# Altium schematic sheet Ambient Light Sensor.SchDoc
size Letter; Organization: Midnight Sun Solar Rayce Car Team; Address1: University of Waterloo; Address2: 200 University Ave W; Address3: Waterloo, ON, Canada; Address4: N2L 3E9; Website: www.uwmidsun.com
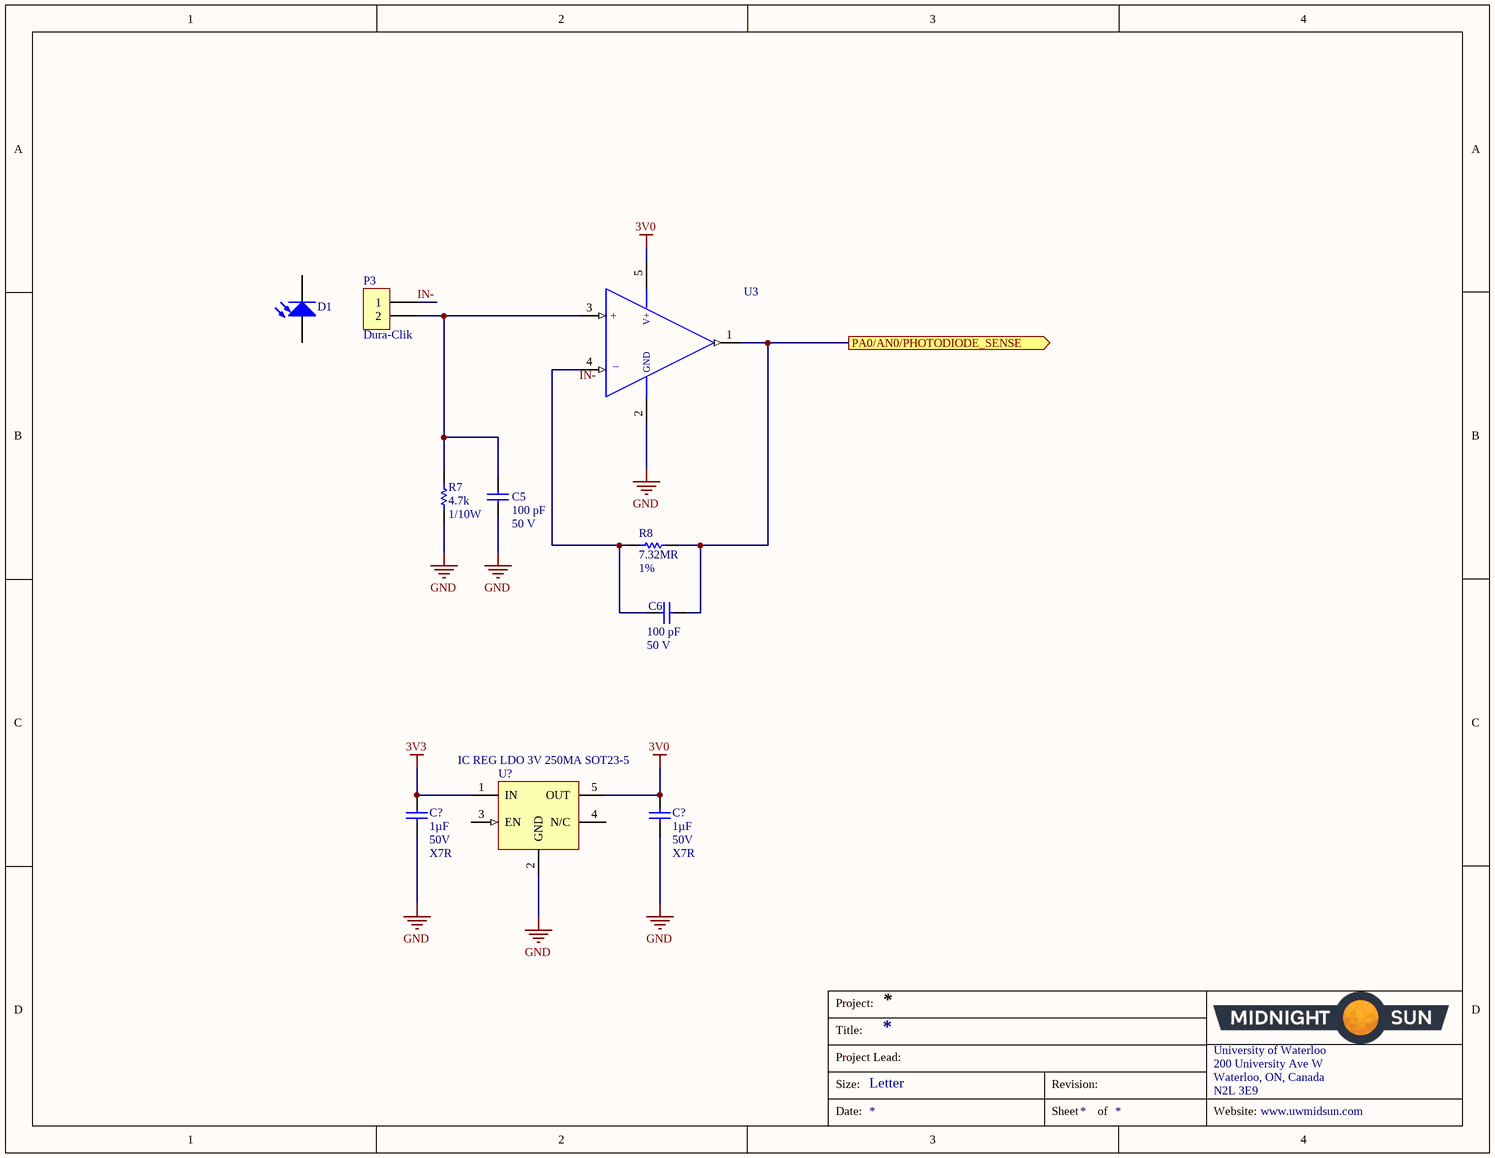
[diagram p0: Ambient Light Sensor.SchDoc]

## Parts
(Parts that share a designator on the sheet are numbered #1, #2 ... from top to bottom, then left to right.)
C5  CAP CER 100PF 50V C0G/NP0 0603  [CAP, 0603]  (value not drawn)
C6  CAP CER 100PF 50V C0G/NP0 0603  [CAP, 0603]  (value not drawn)
C?#1  Capacitance: 1µF  Voltage: 50V  Temperature Coefficient: X7R  [CAP, 0603]  (hidden comment: CAP CER 1UF 50V 10% X7R 0603)
C?#2  Capacitance: 1µF  Voltage: 50V  Temperature Coefficient: X7R  [CAP, 0603]  (hidden comment: CAP CER 1UF 50V 10% X7R 0603)
D1  DIODE 880NM W/FLTR THRUHOLE  (value not drawn)  (graphical)
P3  Dura-Clik  [CONN, 2POS Dura-Click Vertical]
R7  Resistance (Ohms): 4.7k  Power (Watts): 1/10W  [RES, 0603]  (hidden comment: RES 4.7K OHM 1% 1/10W 0603)
R8  Resistance: 7.32MR  Tolerance: 1%  [RES, 0603]  (hidden comment: RES 7.32M OHM 1% 1/10W 0603)
U3  IC OP AMP GEN PURPOSE RR 10MHZ SOT-23-5  [IC OP AMP GP RR 10MHZ SOT-23-5]  (value not drawn)
U?  IC REG LDO 3V 250MA SOT23-5  [SOT95P280X145-5N]

## Ports
PA0/AN0/PHOTODIODE_SENSE (out)

## Nets
3V0: C?#2.1 U3.5(VDD) U?.5(OUT)
3V3: C?#1.1 U?.1(IN)
GND: C5.2 C?#1.2 C?#2.2 R7.1 U3.2(VSS) U?.2(GND)
IN-: P3.1
PA0/AN0/PHOTODIODE_SENSE: C6.2 R8.1 U3.1(OUTPUT) ; port PA0/AN0/PHOTODIODE_SENSE
NetC5_1: C5.1 P3.2 R7.2 U3.3(+IN)
NetC6_1: C6.1 R8.1 U3.4(-IN)

Not connected (* = marked no-connect by the designer): D1 1(A) 2(K); U? 3(EN) 4(N/C)

## Notes on the sheet
- (near C5) 100 pF
- (near C5) 50 V
- (near C6) 100 pF
- (near C6) 50 V
- Project:
- Title:
- Size:
- Project Lead:
- Letter
- Revision:
- University of Waterloo
- 200 University Ave W
- Waterloo, ON, Canada
- N2L 3E9
- Date:
- Sheet
- of
- Website:
- Labels drawn without touching a wire or pin: IN-
- (in symbol IC OP AMP GEN PURPOSE RR 10MHZ SOT-23-5) V+; +; GND; _

## Library data of the parts
C5 C6 = CAP CER 100PF 50V C0G/NP0 0603: 100pF ±1% 50V Ceramic Capacitor C0G, NP0 0603 (1608 Metric); Manufacturer: Kyocera AVX; Manufacturer Part Number: 06035A101FAT2A; Supplier 1: Digi-Key; Stock 1: 176069; Pricing 1: 1=0.24, 10=0.161, 100=0.0814, 500=0.0557, 1000=0.0493 (USD); Mount: Surface Mount; Case/Package: 0603; Case Code (Imperial): 0603; Case Code (Metric): 1608; Min Operating Temperature: -55°C; Max Operating Temperature: 125°C; Capacitance: 100pF; Tolerance: 1%; Packaging: Tape and Reel; Voltage Rating: 50V; Package Quantity: 1; Voltage Rating (DC): 50V; Dielectric: C0G; Termination: SMD/SMT; Voltage: 50V; Length: 1.6mm; Height: 0.86mm; Width: 0.81mm; Thickness: 0.035inch; Depth: 0.81mm; Radiation Hardening: No; REACH SVHC: No SVHC; Lead Free: Lead Free; ComponentLink1URL: https://datasheet.ciiva.com/22682/1796416-22682854.pdf; ComponentLink1Description: https://datasheet.ciiva.com/22682/1796416-22682854.pdf; ComponentLink2URL: https://datasheet.ciiva.com/150/ccog-150746.pdf; ComponentLink2Description: https://datasheet.ciiva.com/150/ccog-150746.pdf; ComponentLink3URL: https://datasheet.ciiva.com/150/ccog-150747.pdf; ComponentLink3Description: https://datasheet.ciiva.com/150/ccog-150747.pdf; ComponentLink4URL: https://datasheet.ciiva.com/150/ccog-150748.pdf; ComponentLink4Description: https://datasheet.ciiva.com/150/ccog-150748.pdf; ComponentLink5URL: https://datasheet.ciiva.com/28585/1796416-28585980.pdf; ComponentLink5Description: https://datasheet.ciiva.com/28585/1796416-28585980.pdf; ComponentLink6URL: https://datasheet.ciiva.com/16300/ccog-16300413.pdf; ComponentLink6Description: https://datasheet.ciiva.com/16300/ccog-16300413.pdf; ComponentLink7URL: https://datasheet.ciiva.com/17492/ccog-17492189.pdf; ComponentLink7Description: https://datasheet.ciiva.com/17492/ccog-17492189.pdf; Supplier Part Number 1: 478-6202-1-ND
C?#1 C?#2 = CAP CER 1UF 50V 10% X7R 0603: 1µF ±10% 50V Ceramic Capacitor X7R 0603 (1608 Metric); Manufacturer 1: Taiyo Yuden; Manufacturer Part Number 1: UMK107AB7105KA-T; Supplier 1: Digi-Key; Supplier Part Number 1: 587-3247-1-ND; Packaging: Cut Tape (CT); Part Status: Active; Operating Temperature: -55°C ~ 125°C; Ratings: -; Mounting Type: Surface Mount, MLCC; Package / Case: 0603 (1608 Metric); Size / Dimension: 0.063" L x 0.031" W (1.60mm x 0.80mm); Height - Seated (Max): -; Thickness (Max): 0.037" (0.95mm); Lead Spacing: -; Lead Style: -; ComponentLink1URL: http://www.yuden.co.jp/productdata/catalog/en/mlcc_all_e.pdf; ComponentLink1Description: http://www.yuden.co.jp/productdata/catalog/en/mlcc_all_e.pdf; Tolerance: ±10%
D1 = DIODE 880NM W/FLTR THRUHOLE: Photodiode 880nm 20ns 120° 2-DIP (0.213", 5.40mm); Manufacturer: Osram Opto; Manufacturer Part Number: BPW34FA; Forward Current: 100mA; Reverse Breakdown Voltage: 32V; Forward Voltage: 1.3V; Max Power Dissipation: 150mW; Polarity: Reverse; Dark Current: 2nA; Diode Type: PIN; Max Reverse Voltage (DC): 16V; Supplier 1: Digi-Key; Stock 1: 7675; Pricing 1: 1=1.12, 10=0.867, 25=0.7188, 100=0.6195, 250=0.5452, 500=0.4708, 1000=0.3717, 2500=0.3469, 5000=0.3345 (USD); Mount: Through Hole,PCB; Case/Package: DIP; Number of Pins: 2; Contact Plating: Tin,Matte; Min Operating Temperature: -40°C; Max Operating Temperature: 100°C; Package Quantity: 1000; Wavelength: 880nm; Viewing Angle: 120°; Rise Time: 20ns; Packaging: Bulk; Fall Time: 20ns; Response Time: 20ns; Power Dissipation: 150mW; Reverse Voltage (DC): 16V; Length: 4.5mm; Height: 2.2mm; Width: 4mm; Radiation Hardening: No; REACH SVHC: No SVHC; ComponentLink1URL: https://datasheet.ciiva.com/1248/1672033-1248688.pdf; ComponentLink1Description: https://datasheet.ciiva.com/1248/1672033-1248688.pdf; ComponentLink2URL: https://datasheet.ciiva.com/4697/pw34fa-pb-free-2007-03-30-21826-4697664.pdf; ComponentLink2Description: https://datasheet.ciiva.com/4697/pw34fa-pb-free-2007-03-30-21826-4697664.pdf; ComponentLink3URL: https://datasheet.ciiva.com/1248/23915-1248689.pdf; ComponentLink3Description: https://datasheet.ciiva.com/1248/23915-1248689.pdf; ComponentLink4URL: https://datasheet.ciiva.com/4269/bpw34faleadpbfreeproduct-rohscompliant-4269826.pdf; ComponentLink4Description: https://datasheet.ciiva.com/4269/bpw34faleadpbfreeproduct-rohscompliant-4269826.pdf; ComponentLink5URL: https://datasheet.ciiva.com/15223/getdatasheetpartid-103433-15223260.pdf; ComponentLink5Description: https://datasheet.ciiva.com/15223/getdatasheetpartid-103433-15223260.pdf; ComponentLink6URL: https://datasheet.ciiva.com/2819/00100764-0-2819838.pdf; ComponentLink6Description: https://datasheet.ciiva.com/2819/00100764-0-2819838.pdf; Supplier Part Number 1: 475-1072-ND
P3 = CONN 2POS DURA-CLIK 0.079" VERT: 2 Positions Header, Shrouded Connector 0.079" (2.00mm) Surface Mount, Vertical Tin; Manufacturer: Molex, LLC; Manufacturer Part Number: 5600200220; Style: Board to Cable/Wire; Shrouding: Shrouded - 4 Wall; Number of Positions: 2; Number of Positions Loaded: All; Mated Stacking Heights: 9.3mm; Supplier 1: Digi-Key; RoHS: RoHS Compliant; Category: Connectors, Interconnects; Stock 1: 11912; Pricing 1: 1=1.16, 10=1.012, 25=0.952, 50=0.9122, 100=0.8727, 250=0.79336 (CAD); Packaging: Cut Tape (CT); Part Status: Active; Connector Type: Header; Contact Type: Male Pin; Pitch - Mating: 0.079" (2.00mm); Number of Rows: 1; Row Spacing - Mating: -; Mounting Type: Surface Mount; Termination: Solder; Fastening Type: Latch Lock; Contact Length - Mating: -; Contact Length - Post: -; Overall Contact Length: -; Insulation Height: 0.315" (8.00mm); Contact Shape: Square; Contact Finish - Mating: Tin; Contact Finish Thickness - Mating: -; Contact Finish - Post: Tin; Contact Material: Copper Alloy; Insulation Material: Polyamide (PA), Nylon; Features: Solder Retention; Operating Temperature: -; Ingress Protection: -; Material Flammability Rating: -; Insulation Color: Natural; Current Rating: -; Voltage Rating: -; Contact Finish Thickness - Post: -; Applications: Automotive, Industrial; ComponentLink1URL: http://www.molex.com/pdm_docs/sd/5600200220_sd.pdf; ComponentLink1Description: http://www.molex.com/pdm_docs/sd/5600200220_sd.pdf; Supplier Part Number 1: WM10862CT-ND
R7 = RES 4.7K OHM 1% 1/10W 0603: 4.7k Ohm ±1% 0.1W, 1/10W Chip Resistor 0603 (1608 Metric) Moisture Resistant Thick Film; Manufacturer 1: Yageo; Manufacturer Part Number 1: RC0603FR-074K7L; Description 1: RES SMD 4.7K OHM 1% 1/10W 0603; Temperature Coefficient: ±100ppm/°C; Supplier 1: Digi-Key; Supplier Part Number 1: 311-4.70KHRCT-ND; RoHS: RoHS Compliant; Category: Resistors; Stock 1: 3487566; Pricing 1: 1=0.16, 10=0.022, 100=0.0089, 1000=0.00402, 2500=0.00349 (CAD); Packaging: Cut Tape (CT); Part Status: Active; Composition: Thick Film; Features: Moisture Resistant; Operating Temperature: -55°C ~ 155°C; Package / Case: 0603 (1608 Metric); Supplier Device Package: 0603; Size / Dimension: 0.063" L x 0.031" W (1.60mm x 0.80mm); Height - Seated (Max): 0.022" (0.55mm); Failure Rate: -; ComponentLink1URL: http://www.yageo.com/documents/recent/PYu-RC_Group_51_RoHS_L_7.pdf; ComponentLink1Description: http://www.yageo.com/documents/recent/PYu-RC_Group_51_RoHS_L_7.pdf; Tolerance: ±1%
R8 = RES 7.32M OHM 1% 1/10W 0603: 7.32 MOhms ±1% 0.1W, 1/10W Chip Resistor 0603 (1608 Metric) Automotive AEC-Q200 Thick Film; Manufacturer: Stackpole Electronics; Manufacturer Part Number: RMCF0603FT7M32; Temperature Coefficient: 200ppm/°C; Supplier 1: Digi-Key; Stock 1: 4815; Pricing 1: 1=0.1, 10=0.016, 100=0.0064, 1000=0.0029, 2500=0.0025 (USD); Mount: Surface Mount; Case/Package: 0603; Contact Plating: Tin,Matte; Min Operating Temperature: -55°C; Max Operating Temperature: 155°C; Packaging: Tape and Reel; Composition: Thick Film; Radiation Hardening: No; ComponentLink1URL: https://www.seielect.com/catalog/SEI-RMCF_RMCP.pdf; ComponentLink1Description: https://www.seielect.com/catalog/SEI-RMCF_RMCP.pdf; Supplier Part Number 1: RMCF0603FT7M32CT-ND
U3 = IC OP AMP GEN PURPOSE RR 10MHZ SOT-23-5: General Purpose Amplifier 1 Circuit Rail-to-Rail SOT-23-5; Manufacturer 1: Texas Instruments; Manufacturer Part Number 1: TLV316QDBVRQ1; Description 1: IC OP AMP GP RR 10MHZ 5-SOT-23; Number of Circuits: 1; Slew Rate: 6 V/µs; Current - Supply: 400µA; Current - Output / Channel: 50mA; Voltage - Supply, Single/Dual (±): 1.8 V ~ 5.5 V, ±0.9 V ~ 2.75 V; Supplier 1: Digi-Key; Supplier Part Number 1: 296-45323-1-ND; RoHS: RoHS Compliant; Category: Integrated Circuits (ICs); Stock 1: 1747; Pricing 1: 1=1.33, 10=1.185, 100=0.9234, 500=0.76276, 1000=0.60218 (CAD); Packaging: Cut Tape (CT); Part Status: Active; Amplifier Type: General Purpose; Output Type: Rail-to-Rail; -3db Bandwidth: -; Operating Temperature: -40°C ~ 125°C; Mounting Type: Surface Mount; Package / Case: SC-74A, SOT-753; Supplier Device Package: SOT-23-5; ComponentLink1URL: http://www.ti.com/lit/ds/symlink/tlv316-q1.pdf; ComponentLink1Description: http://www.ti.com/lit/ds/symlink/tlv316-q1.pdf
U? = IC REG LDO 3V 250MA SOT23-5: Linear Voltage Regulator IC Positive Fixed 1 Output 3V 250mA SOT-23-5; Manufacturer: Texas Instruments; Manufacturer Part Number: LP5907QMFX-3.0Q1; Number of Outputs: 1; Min Input Voltage: 2.2V; Max Input Voltage: 5.5V; Dropout Voltage: 50mV; Quiescent Current: 425uA; Accuracy: 2%; Supplier 1: Digi-Key; Stock 1: 160397; Pricing 1: 1=0.65, 10=0.56, 100=0.4182, 500=0.3286, 1000=0.2539 (USD); Mount: Surface Mount; Min Operating Temperature: -40°C; Max Operating Temperature: 125°C; Max Output Current: 250mA; Output Voltage: 3V; Packaging: Tape and Reel; Output Current: 250mA; Number of Regulators: 1; Polarity: Positive; Radiation Hardening: No; Lead Free: Lead Free; ComponentLink1URL: https://datasheet.ciiva.com/48677/lp5907-q1-48677562.pdf; ComponentLink1Description: https://datasheet.ciiva.com/48677/lp5907-q1-48677562.pdf; Supplier Part Number 1: 296-40364-1-ND